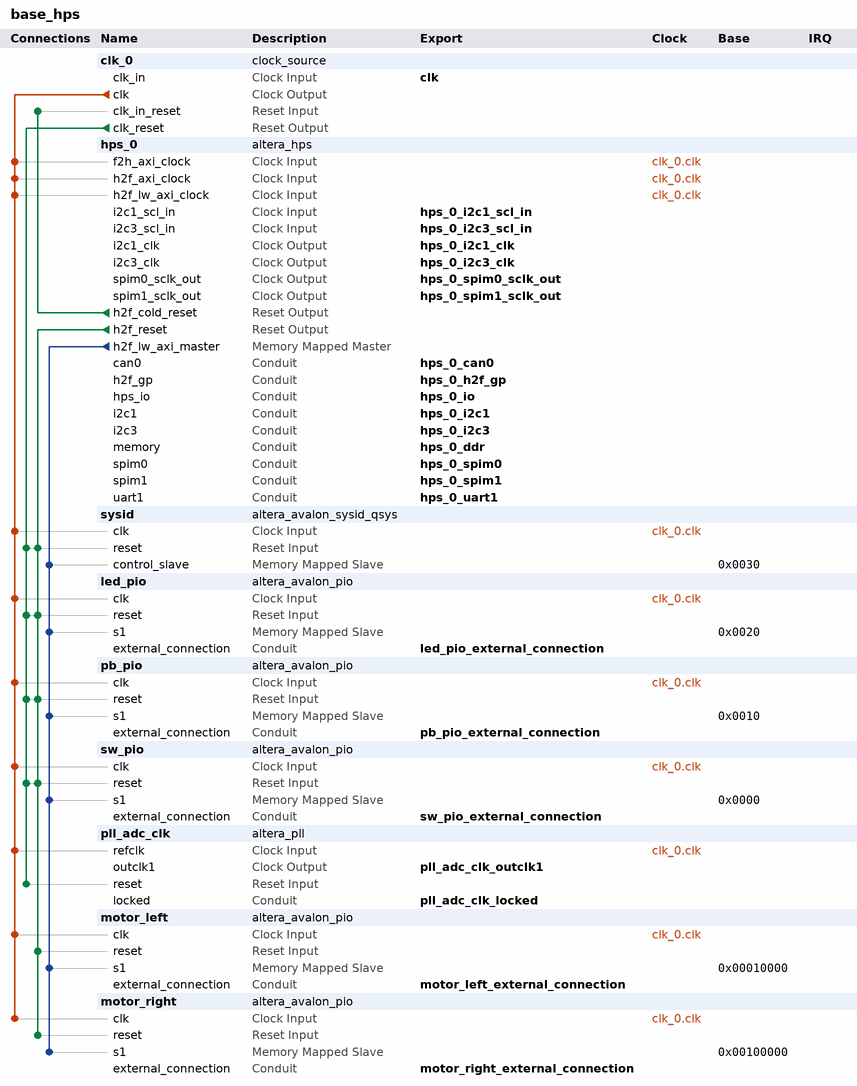
[diagram p0: system contents]
# Platform Designer (Qsys) system base_hps, Cyclone V 5CSEBA6U23I7
# Parameters at their usual value, and those the tool derives, are not listed.
package require -exact qsys 20.1
create_system base_hps
set_project_property DEVICE_FAMILY {Cyclone V}
set_project_property DEVICE 5CSEBA6U23I7

add_instance clk_0 clock_source 20.1
set_instance_parameter_value clk_0 clockFrequency 50000000

add_instance hps_0 altera_hps 20.1
set_instance_parameter_value hps_0 CAN0_Mode Full
set_instance_parameter_value hps_0 CAN0_PinMuxing FPGA
set_instance_parameter_value hps_0 EMAC1_Mode RGMII
set_instance_parameter_value hps_0 EMAC1_PinMuxing {HPS I/O Set 0}
set_instance_parameter_value hps_0 F2SCLK_COLDRST_Enable false
set_instance_parameter_value hps_0 F2SCLK_DBGRST_Enable false
set_instance_parameter_value hps_0 F2SCLK_WARMRST_Enable false
set_instance_parameter_value hps_0 F2SINTERRUPT_Enable false
set_instance_parameter_value hps_0 F2S_Width 1
set_instance_parameter_value hps_0 FPGA_PERIPHERAL_OUTPUT_CLOCK_FREQ_EMAC0_GTX_CLK 125
set_instance_parameter_value hps_0 FPGA_PERIPHERAL_OUTPUT_CLOCK_FREQ_EMAC0_MD_CLK 2.5
set_instance_parameter_value hps_0 FPGA_PERIPHERAL_OUTPUT_CLOCK_FREQ_EMAC1_GTX_CLK 125
set_instance_parameter_value hps_0 FPGA_PERIPHERAL_OUTPUT_CLOCK_FREQ_EMAC1_MD_CLK 2.5
set_instance_parameter_value hps_0 GP_Enable true
set_instance_parameter_value hps_0 HPS_PROTOCOL DDR3
set_instance_parameter_value hps_0 I2C0_Mode I2C
set_instance_parameter_value hps_0 I2C0_PinMuxing {HPS I/O Set 0}
set_instance_parameter_value hps_0 I2C1_Mode Full
set_instance_parameter_value hps_0 I2C1_PinMuxing FPGA
set_instance_parameter_value hps_0 I2C3_Mode Full
set_instance_parameter_value hps_0 I2C3_PinMuxing FPGA
set_instance_parameter_value hps_0 LWH2F_Enable true
set_instance_parameter_value hps_0 MEM_BANKADDR_WIDTH 3
set_instance_parameter_value hps_0 MEM_CLK_FREQ 400.0
set_instance_parameter_value hps_0 MEM_COL_ADDR_WIDTH 10
set_instance_parameter_value hps_0 MEM_DQ_WIDTH 32
set_instance_parameter_value hps_0 MEM_DRV_STR RZQ/6
set_instance_parameter_value hps_0 MEM_ROW_ADDR_WIDTH 15
set_instance_parameter_value hps_0 MEM_RTT_NOM RZQ/6
set_instance_parameter_value hps_0 MEM_RTT_WR {Dynamic ODT off}
set_instance_parameter_value hps_0 MEM_TCL 7
set_instance_parameter_value hps_0 MEM_TFAW_NS 45.0
set_instance_parameter_value hps_0 MEM_TRAS_NS 36.0
set_instance_parameter_value hps_0 MEM_TRCD_NS 13.125
set_instance_parameter_value hps_0 MEM_TRFC_NS 300.0
set_instance_parameter_value hps_0 MEM_TRP_NS 13.125
set_instance_parameter_value hps_0 MEM_VENDOR Micron
set_instance_parameter_value hps_0 MEM_WTCL 7
set_instance_parameter_value hps_0 QSPI_Mode N/A
set_instance_parameter_value hps_0 QSPI_PinMuxing Unused
set_instance_parameter_value hps_0 REF_CLK_FREQ 25.0
set_instance_parameter_value hps_0 S2FCLK_COLDRST_Enable true
set_instance_parameter_value hps_0 S2FCLK_PENDINGRST_Enable true
set_instance_parameter_value hps_0 S2FCLK_USER2CLK 5
set_instance_parameter_value hps_0 S2F_Width 1
set_instance_parameter_value hps_0 SDIO_Mode {4-bit Data}
set_instance_parameter_value hps_0 SDIO_PinMuxing {HPS I/O Set 0}
set_instance_parameter_value hps_0 SPIM0_Mode Full
set_instance_parameter_value hps_0 SPIM0_PinMuxing FPGA
set_instance_parameter_value hps_0 SPIM1_Mode Full
set_instance_parameter_value hps_0 SPIM1_PinMuxing FPGA
set_instance_parameter_value hps_0 STM_Enable false
set_instance_parameter_value hps_0 TIMING_BOARD_AC_SKEW 0.02
set_instance_parameter_value hps_0 TIMING_BOARD_AC_TO_CK_SKEW 0.01
set_instance_parameter_value hps_0 TIMING_BOARD_DQ_TO_DQS_SKEW 0.05
set_instance_parameter_value hps_0 TIMING_BOARD_MAX_CK_DELAY 0.03
set_instance_parameter_value hps_0 TIMING_BOARD_MAX_DQS_DELAY 0.02
set_instance_parameter_value hps_0 TIMING_BOARD_SKEW_BETWEEN_DQS 0.06
set_instance_parameter_value hps_0 TIMING_BOARD_SKEW_CKDQS_DIMM_MAX 0.12
set_instance_parameter_value hps_0 TIMING_BOARD_SKEW_CKDQS_DIMM_MIN 0.06
set_instance_parameter_value hps_0 TIMING_BOARD_SKEW_WITHIN_DQS 0.01
set_instance_parameter_value hps_0 TIMING_TDH 65
set_instance_parameter_value hps_0 TIMING_TDQSCK 255
set_instance_parameter_value hps_0 TIMING_TDQSQ 125
set_instance_parameter_value hps_0 TIMING_TDS 30
set_instance_parameter_value hps_0 TIMING_TIH 140
set_instance_parameter_value hps_0 TIMING_TIS 190
set_instance_parameter_value hps_0 TIMING_TQSH 0.4
set_instance_parameter_value hps_0 UART0_Mode {No Flow Control}
set_instance_parameter_value hps_0 UART0_PinMuxing {HPS I/O Set 0}
set_instance_parameter_value hps_0 UART1_Mode Full
set_instance_parameter_value hps_0 UART1_PinMuxing FPGA
set_instance_parameter_value hps_0 USB1_Mode SDR
set_instance_parameter_value hps_0 USB1_PinMuxing {HPS I/O Set 0}
set_instance_parameter_value hps_0 desired_cfg_clk_mhz 100.0
set_instance_parameter_value hps_0 desired_qspi_clk_mhz 400.0

add_instance sysid altera_avalon_sysid_qsys 20.1
set_instance_parameter_value sysid id -889279268

add_instance led_pio altera_avalon_pio 20.1
set_instance_parameter_value led_pio direction Output
set_instance_parameter_value led_pio resetValue 85
set_instance_parameter_value led_pio width 8

add_instance pb_pio altera_avalon_pio 20.1
set_instance_parameter_value pb_pio direction Input
set_instance_parameter_value pb_pio width 2

add_instance sw_pio altera_avalon_pio 20.1
set_instance_parameter_value sw_pio direction Input
set_instance_parameter_value sw_pio width 4

add_instance pll_adc_clk altera_pll 20.1
set_instance_parameter_value pll_adc_clk gui_device_speed_grade 2
set_instance_parameter_value pll_adc_clk gui_number_of_clocks 2
set_instance_parameter_value pll_adc_clk gui_operation_mode normal
set_instance_parameter_value pll_adc_clk gui_output_clock_frequency0 40.0
set_instance_parameter_value pll_adc_clk gui_output_clock_frequency1 200.0
set_instance_parameter_value pll_adc_clk gui_pll_mode {Integer-N PLL}
set_instance_parameter_value pll_adc_clk gui_reference_clock_frequency 50.0
set_instance_parameter_value pll_adc_clk gui_use_locked true

add_instance motor_left altera_avalon_pio 20.1
set_instance_parameter_value motor_left direction Output
set_instance_parameter_value motor_left width 9

add_instance motor_right altera_avalon_pio 20.1
set_instance_parameter_value motor_right direction Output
set_instance_parameter_value motor_right width 9

# connections
add_connection clk_0.clk hps_0.f2h_axi_clock clock
add_connection clk_0.clk hps_0.h2f_axi_clock clock
add_connection clk_0.clk hps_0.h2f_lw_axi_clock clock
add_connection clk_0.clk led_pio.clk clock
add_connection clk_0.clk motor_left.clk clock
add_connection clk_0.clk motor_right.clk clock
add_connection clk_0.clk pb_pio.clk clock
add_connection clk_0.clk pll_adc_clk.refclk clock
add_connection clk_0.clk sw_pio.clk clock
add_connection clk_0.clk sysid.clk clock
add_connection clk_0.clk_reset led_pio.reset reset
add_connection clk_0.clk_reset pb_pio.reset reset
add_connection clk_0.clk_reset pll_adc_clk.reset reset
add_connection clk_0.clk_reset sw_pio.reset reset
add_connection clk_0.clk_reset sysid.reset reset
add_connection hps_0.h2f_cold_reset clk_0.clk_in_reset reset
add_connection hps_0.h2f_reset led_pio.reset reset
add_connection hps_0.h2f_reset motor_left.reset reset
add_connection hps_0.h2f_reset motor_right.reset reset
add_connection hps_0.h2f_reset pb_pio.reset reset
add_connection hps_0.h2f_reset sw_pio.reset reset
add_connection hps_0.h2f_reset sysid.reset reset
add_connection hps_0.h2f_lw_axi_master led_pio.s1 avalon
set_connection_parameter_value hps_0.h2f_lw_axi_master/led_pio.s1 baseAddress 0x0020
add_connection hps_0.h2f_lw_axi_master motor_left.s1 avalon
set_connection_parameter_value hps_0.h2f_lw_axi_master/motor_left.s1 baseAddress 0x00010000
add_connection hps_0.h2f_lw_axi_master motor_right.s1 avalon
set_connection_parameter_value hps_0.h2f_lw_axi_master/motor_right.s1 baseAddress 0x00100000
add_connection hps_0.h2f_lw_axi_master pb_pio.s1 avalon
set_connection_parameter_value hps_0.h2f_lw_axi_master/pb_pio.s1 baseAddress 0x0010
add_connection hps_0.h2f_lw_axi_master sw_pio.s1 avalon
set_connection_parameter_value hps_0.h2f_lw_axi_master/sw_pio.s1 baseAddress 0x0000
add_connection hps_0.h2f_lw_axi_master sysid.control_slave avalon
set_connection_parameter_value hps_0.h2f_lw_axi_master/sysid.control_slave baseAddress 0x0030

# exported interfaces
add_interface clk clock sink
set_interface_property clk EXPORT_OF clk_0.clk_in
add_interface hps_0_can0 conduit end
set_interface_property hps_0_can0 EXPORT_OF hps_0.can0
add_interface hps_0_ddr conduit end
set_interface_property hps_0_ddr EXPORT_OF hps_0.memory
add_interface hps_0_h2f_gp conduit end
set_interface_property hps_0_h2f_gp EXPORT_OF hps_0.h2f_gp
add_interface hps_0_i2c1 conduit end
set_interface_property hps_0_i2c1 EXPORT_OF hps_0.i2c1
add_interface hps_0_i2c1_clk clock source
set_interface_property hps_0_i2c1_clk EXPORT_OF hps_0.i2c1_clk
add_interface hps_0_i2c1_scl_in clock sink
set_interface_property hps_0_i2c1_scl_in EXPORT_OF hps_0.i2c1_scl_in
add_interface hps_0_i2c3 conduit end
set_interface_property hps_0_i2c3 EXPORT_OF hps_0.i2c3
add_interface hps_0_i2c3_clk clock source
set_interface_property hps_0_i2c3_clk EXPORT_OF hps_0.i2c3_clk
add_interface hps_0_i2c3_scl_in clock sink
set_interface_property hps_0_i2c3_scl_in EXPORT_OF hps_0.i2c3_scl_in
add_interface hps_0_io conduit end
set_interface_property hps_0_io EXPORT_OF hps_0.hps_io
add_interface hps_0_spim0 conduit end
set_interface_property hps_0_spim0 EXPORT_OF hps_0.spim0
add_interface hps_0_spim0_sclk_out clock source
set_interface_property hps_0_spim0_sclk_out EXPORT_OF hps_0.spim0_sclk_out
add_interface hps_0_spim1 conduit end
set_interface_property hps_0_spim1 EXPORT_OF hps_0.spim1
add_interface hps_0_spim1_sclk_out clock source
set_interface_property hps_0_spim1_sclk_out EXPORT_OF hps_0.spim1_sclk_out
add_interface hps_0_uart1 conduit end
set_interface_property hps_0_uart1 EXPORT_OF hps_0.uart1
add_interface led_pio_external_connection conduit end
set_interface_property led_pio_external_connection EXPORT_OF led_pio.external_connection
add_interface motor_left_external_connection conduit end
set_interface_property motor_left_external_connection EXPORT_OF motor_left.external_connection
add_interface motor_right_external_connection conduit end
set_interface_property motor_right_external_connection EXPORT_OF motor_right.external_connection
add_interface pb_pio_external_connection conduit end
set_interface_property pb_pio_external_connection EXPORT_OF pb_pio.external_connection
add_interface pll_adc_clk_locked conduit end
set_interface_property pll_adc_clk_locked EXPORT_OF pll_adc_clk.locked
add_interface pll_adc_clk_outclk1 clock source
set_interface_property pll_adc_clk_outclk1 EXPORT_OF pll_adc_clk.outclk1
add_interface sw_pio_external_connection conduit end
set_interface_property sw_pio_external_connection EXPORT_OF sw_pio.external_connection

set_interconnect_requirement {$system} qsys_mm.clockCrossingAdapter HANDSHAKE
set_interconnect_requirement {$system} qsys_mm.enableEccProtection FALSE
set_interconnect_requirement {$system} qsys_mm.insertDefaultSlave FALSE
set_interconnect_requirement {$system} qsys_mm.maxAdditionalLatency 1

save_system base_hps.qsys
